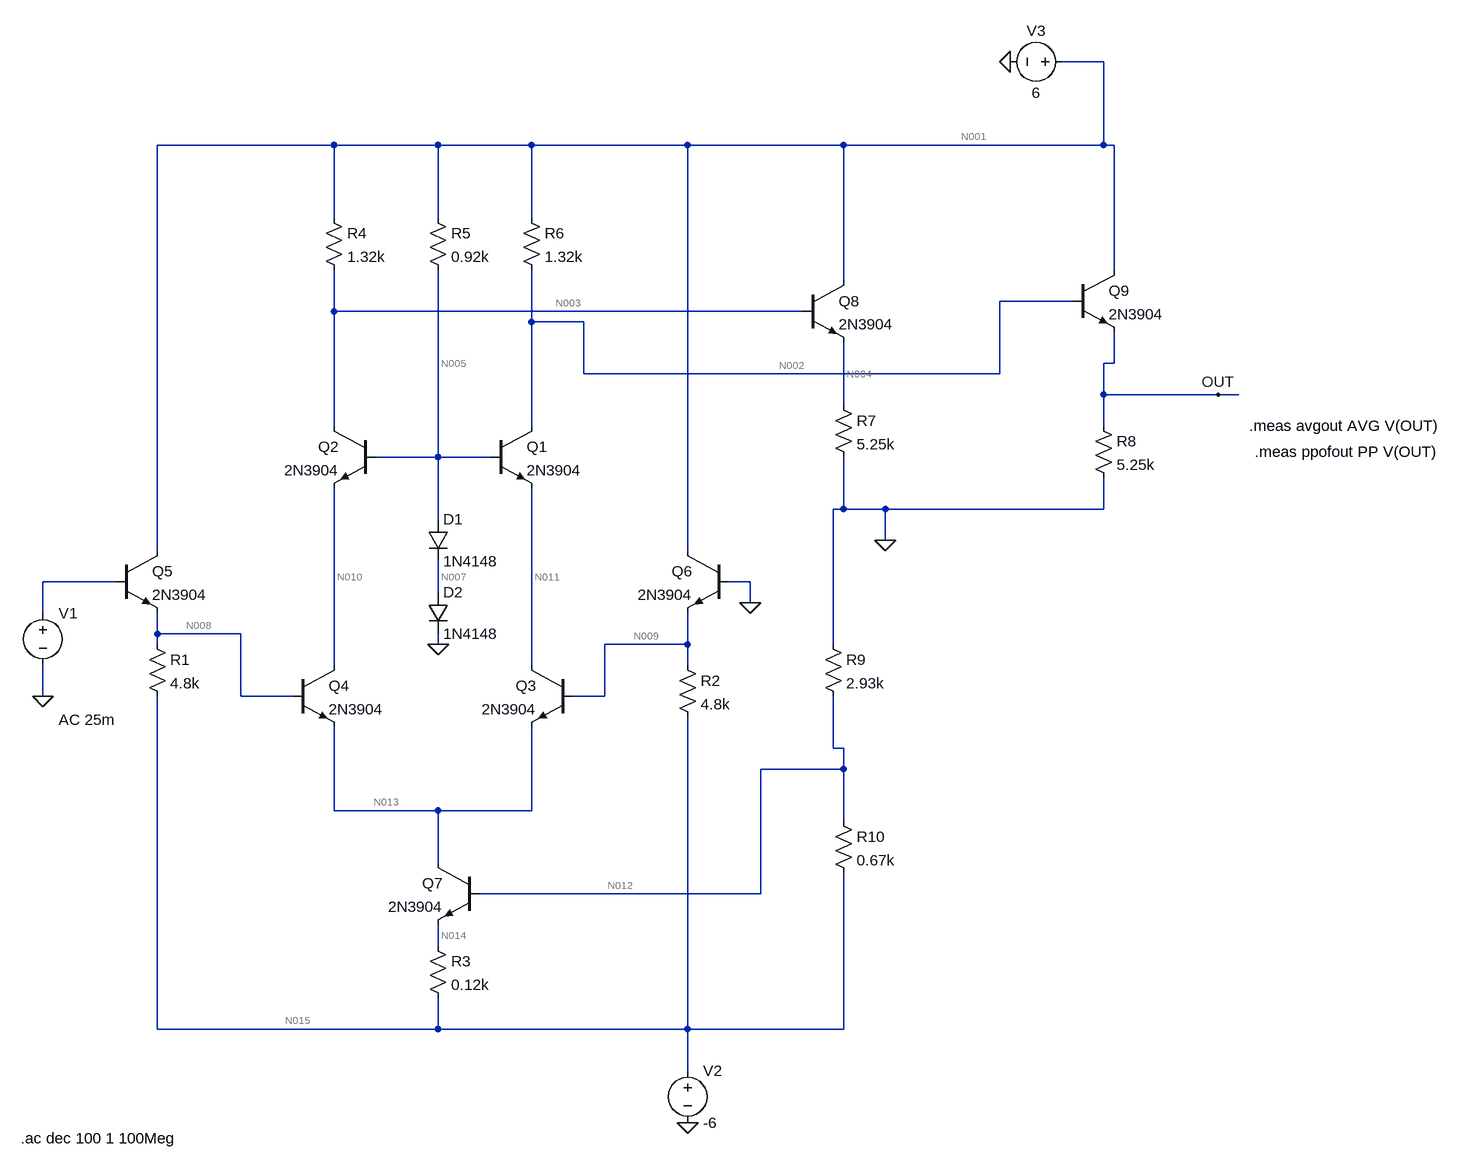
[diagram p0: schematic 3_28.asc]
3_28.asc, the LTspice schematic file:
Version 4
SHEET 1 1664 1192
WIRE 1136 -480 1072 -480
WIRE -48 -352 -320 -352
WIRE 112 -352 -48 -352
WIRE 256 -352 112 -352
WIRE 496 -352 256 -352
WIRE 736 -352 496 -352
WIRE 1136 -352 1136 -480
WIRE 1136 -352 736 -352
WIRE 1152 -352 1136 -352
WIRE -48 -240 -48 -352
WIRE 112 -240 112 -352
WIRE 256 -240 256 -352
WIRE 1152 -160 1152 -352
WIRE 736 -144 736 -352
WIRE 1088 -112 976 -112
WIRE -48 -96 -48 -160
WIRE 672 -96 -48 -96
WIRE 256 -80 256 -160
WIRE 336 -80 256 -80
WIRE 1152 -16 1152 -64
WIRE 1152 -16 1136 -16
WIRE 336 0 336 -80
WIRE 976 0 976 -112
WIRE 976 0 336 0
WIRE 1136 32 1136 -16
WIRE 1312 32 1136 32
WIRE 1344 32 1312 32
WIRE 736 48 736 -48
WIRE -48 80 -48 -96
WIRE 256 80 256 -80
WIRE 1136 80 1136 32
WIRE 112 128 112 -160
WIRE 112 128 16 128
WIRE 192 128 112 128
WIRE 736 208 736 128
WIRE 736 208 720 208
WIRE 800 208 736 208
WIRE 1136 208 1136 160
WIRE 1136 208 800 208
WIRE 112 224 112 128
WIRE 800 256 800 208
WIRE -320 272 -320 -352
WIRE 496 272 496 -352
WIRE -384 320 -496 320
WIRE 592 320 560 320
WIRE 112 336 112 288
WIRE 592 352 592 320
WIRE -496 368 -496 320
WIRE -320 400 -320 368
WIRE -192 400 -320 400
WIRE -320 416 -320 400
WIRE 112 416 112 400
WIRE 496 416 496 368
WIRE 496 416 368 416
WIRE 720 416 720 208
WIRE -48 448 -48 176
WIRE 256 448 256 176
WIRE 496 448 496 416
WIRE -496 496 -496 448
WIRE -192 496 -192 400
WIRE -112 496 -192 496
WIRE 368 496 368 416
WIRE 368 496 320 496
WIRE 720 576 720 496
WIRE 736 576 720 576
WIRE 736 608 736 576
WIRE 736 608 608 608
WIRE -48 672 -48 544
WIRE 112 672 -48 672
WIRE 256 672 256 544
WIRE 256 672 112 672
WIRE 736 688 736 608
WIRE 112 752 112 672
WIRE 608 800 608 608
WIRE 608 800 176 800
WIRE 112 880 112 848
WIRE -320 1008 -320 496
WIRE 112 1008 112 960
WIRE 112 1008 -320 1008
WIRE 496 1008 496 528
WIRE 496 1008 112 1008
WIRE 736 1008 736 768
WIRE 736 1008 496 1008
WIRE 496 1072 496 1008
FLAG 112 416 0
FLAG -496 496 0
FLAG 592 352 0
FLAG 800 256 0
FLAG 992 -480 0
FLAG 496 1152 0
FLAG 1312 32 OUT
SYMBOL npn 192 80 R0
SYMATTR InstName Q1
SYMATTR Value 2N3904
SYMBOL npn 16 80 M0
SYMATTR InstName Q2
SYMATTR Value 2N3904
SYMBOL npn 320 448 M0
SYMATTR InstName Q3
SYMATTR Value 2N3904
SYMBOL npn -112 448 R0
SYMATTR InstName Q4
SYMATTR Value 2N3904
SYMBOL diode 96 224 R0
SYMATTR InstName D1
SYMATTR Value 1N4148
SYMBOL diode 96 336 R0
SYMATTR InstName D2
SYMATTR Value 1N4148
SYMBOL npn -384 272 R0
SYMATTR InstName Q5
SYMATTR Value 2N3904
SYMBOL npn 560 272 M0
SYMATTR InstName Q6
SYMATTR Value 2N3904
SYMBOL res -336 400 R0
SYMATTR InstName R1
SYMATTR Value 4.8k
SYMBOL res 480 432 R0
SYMATTR InstName R2
SYMATTR Value 4.8k
SYMBOL npn 176 752 M0
SYMATTR InstName Q7
SYMATTR Value 2N3904
SYMBOL res 96 864 R0
SYMATTR InstName R3
SYMATTR Value 0.12k
SYMBOL voltage -496 352 R0
WINDOW 3 24 152 Left 2
WINDOW 123 24 180 Left 2
WINDOW 39 0 0 Left 0
SYMATTR InstName V1
SYMATTR Value ""
SYMATTR Value2 AC 25m
SYMBOL res -64 -256 R0
SYMATTR InstName R4
SYMATTR Value 1.32k
SYMBOL res 96 -256 R0
SYMATTR InstName R5
SYMATTR Value 0.92k
SYMBOL res 240 -256 R0
SYMATTR InstName R6
SYMATTR Value 1.32k
SYMBOL res 720 32 R0
SYMATTR InstName R7
SYMATTR Value 5.25k
SYMBOL npn 672 -144 R0
SYMATTR InstName Q8
SYMATTR Value 2N3904
SYMBOL npn 1088 -160 R0
SYMATTR InstName Q9
SYMATTR Value 2N3904
SYMBOL res 1120 64 R0
SYMATTR InstName R8
SYMATTR Value 5.25k
SYMBOL res 704 400 R0
SYMATTR InstName R9
SYMATTR Value 2.93k
SYMBOL res 720 672 R0
SYMATTR InstName R10
SYMATTR Value 0.67k
SYMBOL voltage 496 1056 R0
WINDOW 123 0 0 Left 0
WINDOW 39 0 0 Left 0
SYMATTR InstName V2
SYMATTR Value -6
SYMBOL voltage 1088 -480 R90
WINDOW 0 -32 56 VBottom 2
WINDOW 3 32 56 VTop 2
WINDOW 123 0 0 Left 0
WINDOW 39 0 0 Left 0
SYMATTR InstName V3
SYMATTR Value 6
TEXT 1360 80 Left 2 !.meas avgout AVG V(OUT)
TEXT 1368 120 Left 2 !.meas ppofout PP V(OUT)
TEXT -530 1176 Left 2 !.ac dec 100 1 100Meg

The netlist it stands for:
* 3_28.asc
Q1 N002 N005 N011 0 2N3904
Q2 N003 N005 N010 0 2N3904
Q3 N011 N009 N013 0 2N3904
Q4 N010 N008 N013 0 2N3904
D1 N005 N007 1N4148
D2 N007 0 1N4148
Q5 N001 N006 N008 0 2N3904
Q6 N001 0 N009 0 2N3904
R1 N008 N015 4.8k
R2 N009 N015 4.8k
Q7 N013 N012 N014 0 2N3904
R3 N014 N015 0.12k
V1 N006 0 AC 25m
R4 N001 N003 1.32k
R5 N001 N005 0.92k
R6 N001 N002 1.32k
R7 N004 0 5.25k
Q8 N001 N003 N004 0 2N3904
Q9 N001 N002 OUT 0 2N3904
R8 OUT 0 5.25k
R9 0 N012 2.93k
R10 N012 N015 0.67k
V2 N015 0 -6
V3 N001 0 6
.model D D
.lib standard.dio
.model NPN NPN
.model PNP PNP
.lib standard.bjt
.meas avgout AVG V(OUT)
.meas ppofout PP V(OUT)
.ac dec 100 1 100Meg
.backanno
.end

* Results of the author's LTspice run, read from the files saved beside the schematic
* Operating Point, zero values left out:
*   V(n002) = 3.694 V
*   V(n005) = 1.321 V
*   V(n011) = 652 mV
*   V(n003) = 3.694 V
*   V(n010) = 652 mV
*   V(n009) = -656.7 mV
*   V(n013) = -1.326 V
*   V(n008) = -656.7 mV
*   V(n007) = 660.7 mV
*   V(n001) = 6 V
*   V(n015) = -6 V
*   V(n012) = -4.89 V
*   V(n014) = -5.577 V
*   V(n004) = 3.053 V
*   V(out) = 3.053 V
*   Ic(Q9) = 579.7 µA
*   Ib(Q9) = 1.892 µA
*   Ie(Q9) = -581.6 µA
*   Ic(Q8) = 579.7 µA
*   Ib(Q8) = 1.892 µA
*   Ie(Q8) = -581.6 µA
*   Ic(Q7) = 3.513 mA
*   Ib(Q7) = 11.4 µA
*   Ie(Q7) = -3.524 mA
*   Ic(Q6) = 1.115 mA
*   Ib(Q6) = 3.517 µA
*   Ie(Q6) = -1.119 mA
*   Ic(Q5) = 1.115 mA
*   Ib(Q5) = 3.517 µA
*   Ie(Q5) = -1.119 mA
*   Ic(Q4) = 1.751 mA
*   Ib(Q4) = 5.785 µA
*   Ie(Q4) = -1.757 mA
*   Ic(Q3) = 1.751 mA
*   Ib(Q3) = 5.785 µA
*   Ie(Q3) = -1.757 mA
*   Ic(Q2) = 1.745 mA
*   Ib(Q2) = 5.706 µA
*   Ie(Q2) = -1.751 mA
*   Ic(Q1) = 1.745 mA
*   Ib(Q1) = 5.706 µA
*   Ie(Q1) = -1.751 mA
*   I(D2) = 5.074 mA
*   I(D1) = 5.074 mA
*   I(R10) = 1.657 mA
*   I(R9) = 1.669 mA
*   I(R8) = 581.6 µA
*   I(R7) = 581.6 µA
*   I(R6) = 1.747 mA
*   I(R5) = 5.086 mA
*   I(R4) = 1.747 mA
*   I(R3) = 3.524 mA
*   I(R2) = 1.113 mA
*   I(R1) = 1.113 mA
*   I(V3) = -11.97 mA
*   I(V2) = 7.408 mA
*   I(V1) = -3.517 µA
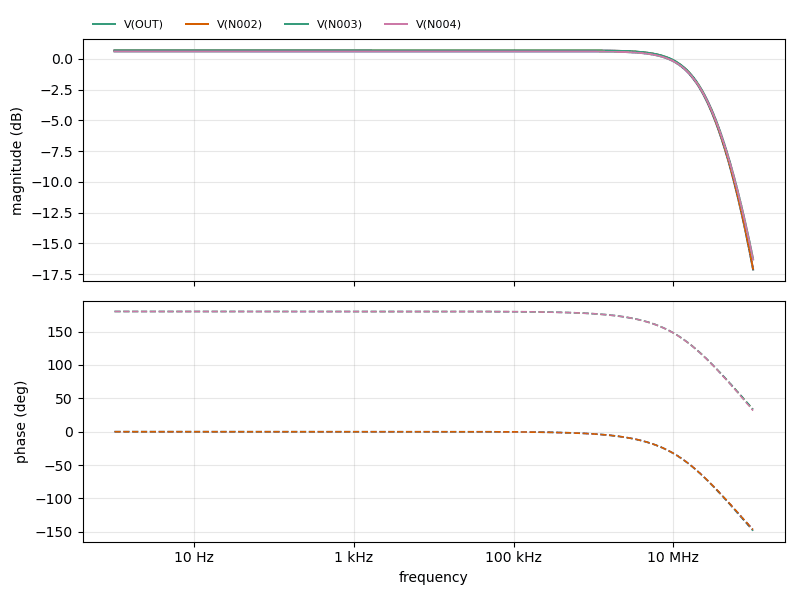
[diagram p1: AC Analysis of 3_28.asc, plotted from the saved traces]
* AC Analysis, 1 run:
*   V(OUT): 0.62 dB at 1 Hz, -17.13 dB at 100 MHz, peak 0.62 dB at 1.096 Hz, 3 dB below the peak at 21.51 MHz
*   V(N002): 0.70 dB at 1 Hz, -17.06 dB at 100 MHz, peak 0.70 dB at 1 Hz, 3 dB below the peak at 21.5 MHz
*   V(N003): 0.70 dB at 1 Hz, -16.24 dB at 100 MHz, peak 0.70 dB at 1 Hz, 3 dB below the peak at 21.85 MHz
*   V(N004): 0.62 dB at 1 Hz, -16.31 dB at 100 MHz, peak 0.62 dB at 1 Hz, 3 dB below the peak at 21.85 MHz
* From the log:
*   avgout: AVG(v(out))=0.47506 FROM 1 TO 1e+008
*   ppofout: PP(v(out))=(17.7528dB,148.38°) FROM 1 TO 1e+008